# Altium project amoled-watch.PrjPcb
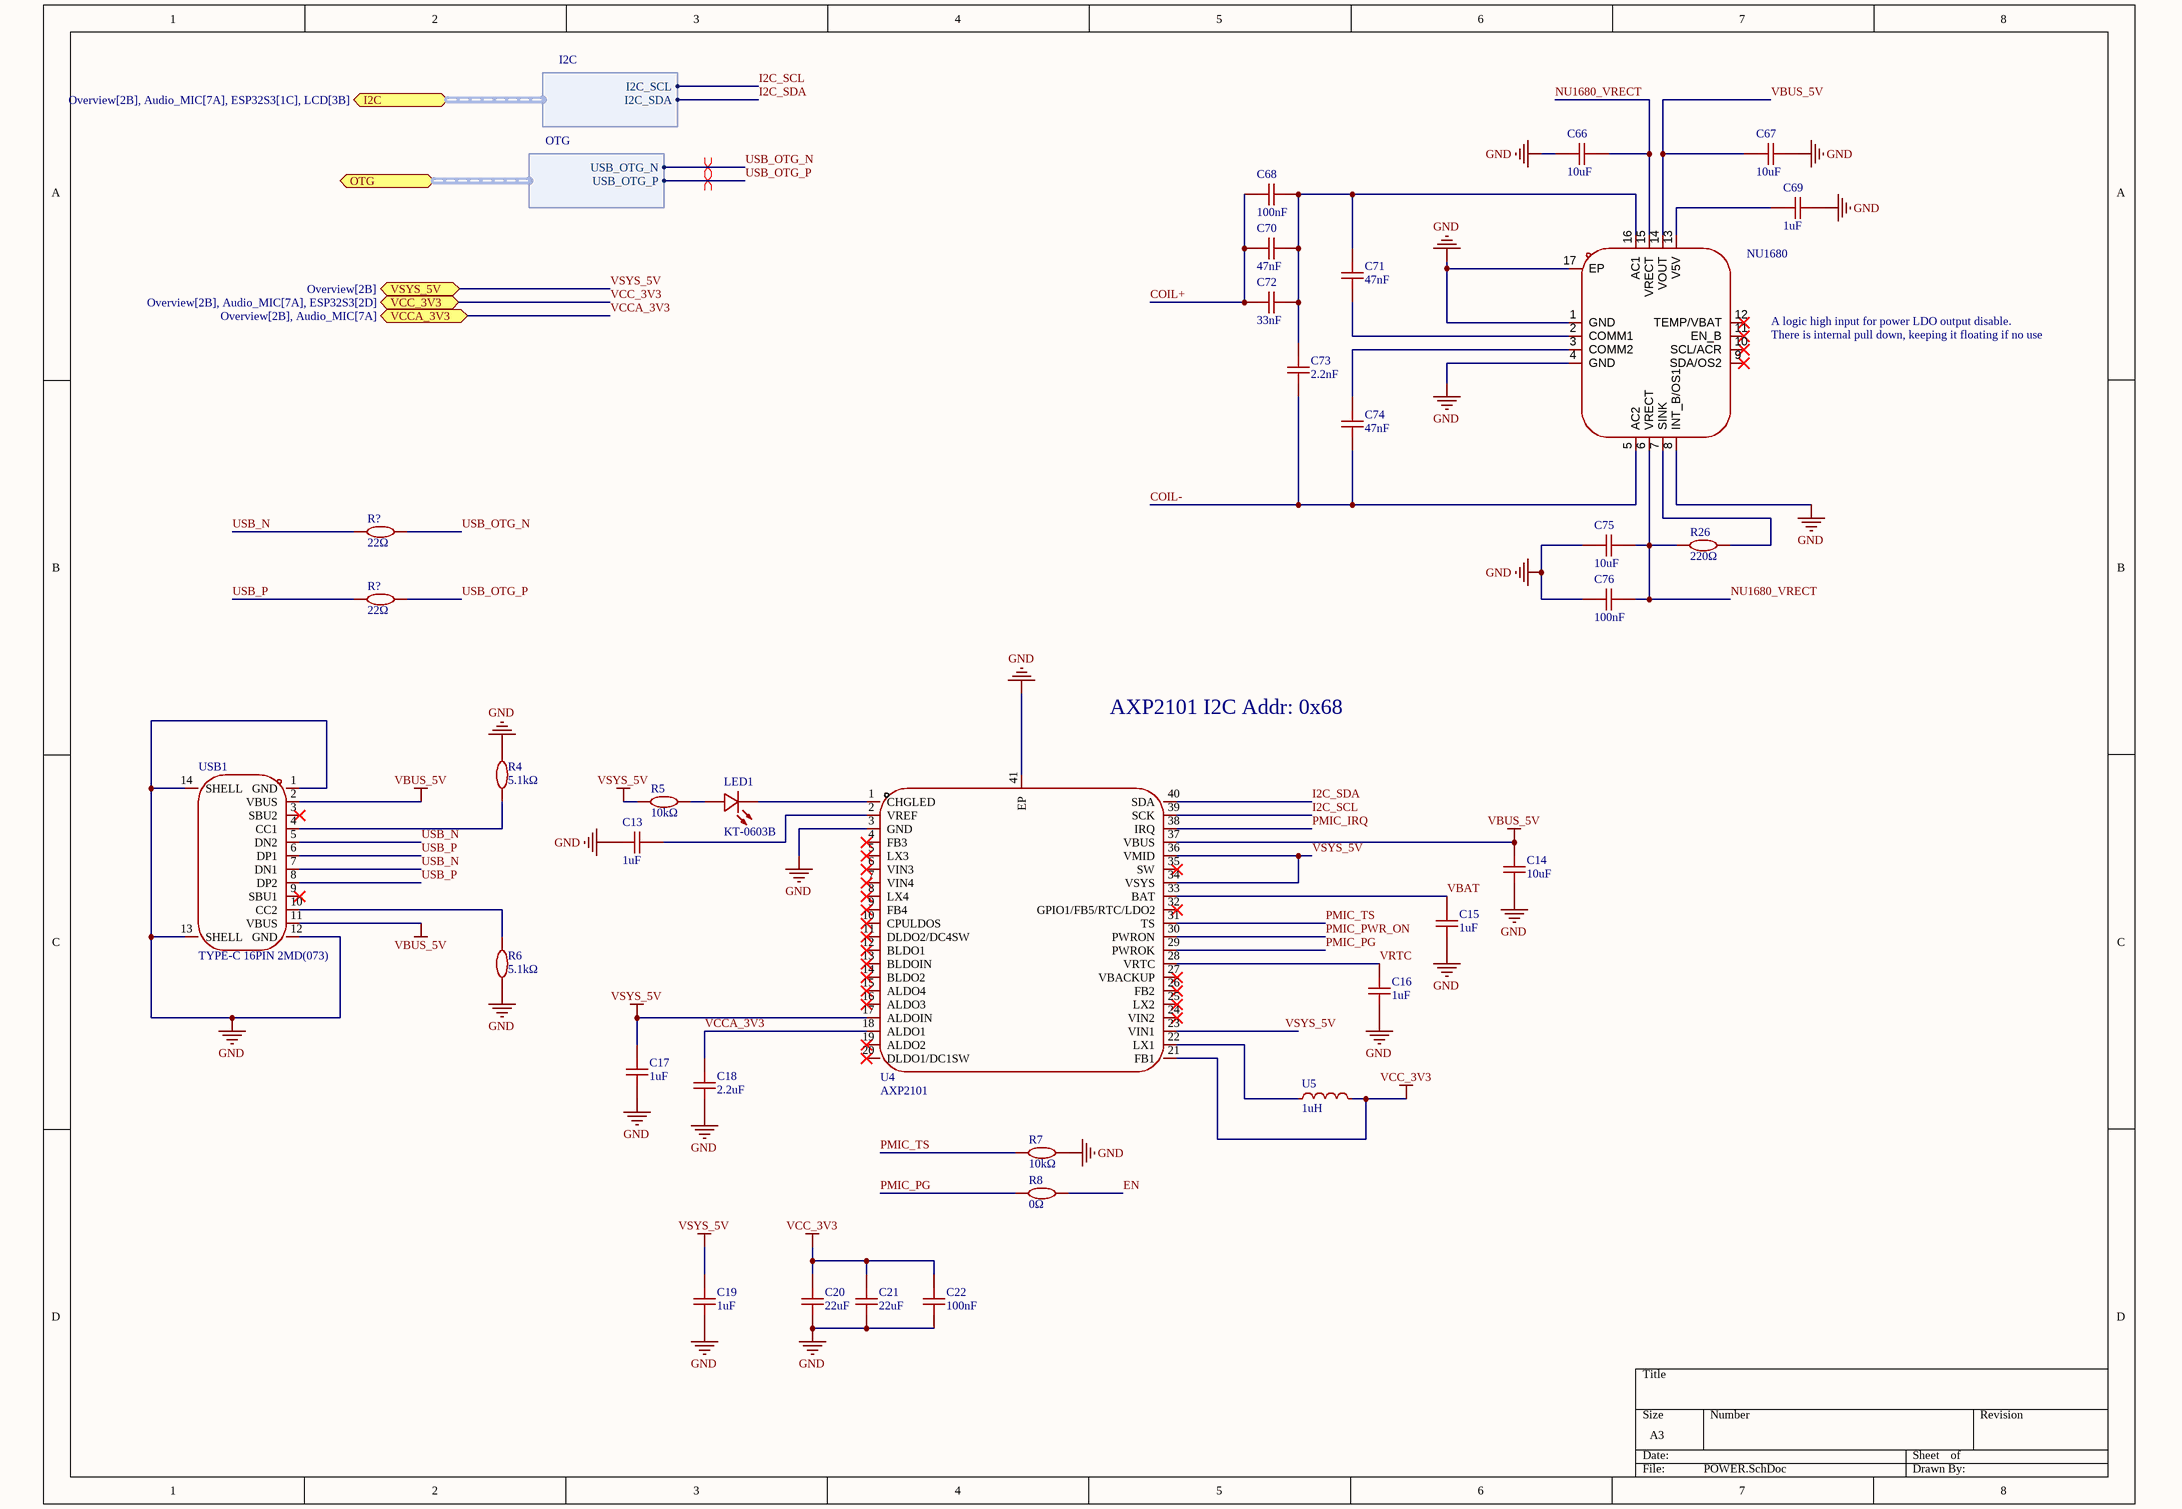
[diagram p0: POWER.SchDoc]
3 sheets, 77 parts. Net scope: flat (ports and power ports of the same name join across sheets).
Board file: PCB1.PcbDoc
Sheets:
  POWER.SchDoc
  ESP32S3.SchDoc
  Sensor.SchDoc

## Sheet POWER.SchDoc
size A3; SheetNumber: 2; SheetTotal: 7

### Parts
(Parts that share a designator on the sheet are numbered #1, #2 ... from top to bottom, then left to right.)
C13  1uF  [C0402]
C14  10uF  [C0603]
C15  1uF  [C0402]
C16  1uF  [C0402]
C17  1uF  [C0402]
C18  2.2uF  [C0402]
C19  1uF  [C0402]
C20  22uF  [C0603]
C21  22uF  [C0603]
C22  100nF  [C0402]
C66  10uF  [C0603]
C67  10uF  [C0603]
C68  100nF  [C0402]
C69  1uF  [C0402]
C70  47nF  [C0402]
C71  47nF  [C0402]
C72  33nF  [C0402]
C73  2.2nF  [C0402]
C74  47nF  [C0402]
C75  10uF  [C0603]
C76  100nF  [C0402]
LED1  KT-0603B  [LED0603-BL]
R4  5.1kΩ  [R0402]
R5  10kΩ  [R0402]
R6  5.1kΩ  [R0402]
R7  10kΩ  [R0402]
R8  0Ω  [R0402]
R26  220Ω  [R0402]
R?#1  22Ω  [R0402]
R?#2  22Ω  [R0402]
U4  AXP2101  [QFN-40_L5.0-W5.0-P0.40-TL-EP3.4]
U5  1uH  [IND-SMD_L2.5-W2.0_WPN252012H]
U12  NU1680  [QFN-16_L3.0-W3.0-P0.50-TL-EP1.9]
USB1  TYPE-C 16PIN 2MD(073)  [USB-C-SMD_TYPE-C-6PIN-2MD-073]

### Ports
I2C (bidir, harness I2C, see Overview[2B], Audio_MIC[7A], ESP32S3[1C], LCD[3B]), OTG (bidir, harness OTG), VCC_3V3 (bidir, see Overview[2B], Audio_MIC[7A], ESP32S3[2D]), VCCA_3V3 (bidir, see Overview[2B], Audio_MIC[7A]), VSYS_5V (bidir, see Overview[2B])

### Harnesses
OTG: USB_OTG_N, USB_OTG_P
I2C: I2C_SCL, I2C_SDA

### Nets
GND: C13.1 C14.1 C15.1 C16.1 C17.1 C18.1 C19.1 C20.1 C21.1 C22.1 C66.2 C67.1 C69.1 C75.2 C76.2 R4.2 R6.1 R7.2 U4.3(GND) U4.41(EP) U12.1(GND) U12.4(GND) U12.8(INT_B/OS1) U12.17(EP) USB1.1(GND) USB1.12(GND) USB1.13(SHELL) USB1.14(SHELL)
VBUS_5V: C14.2 C67.2 U4.37(VBUS) U12.14(VOUT) USB1.2(VBUS) USB1.11(VBUS)
VCC_3V3: C20.2 C21.2 C22.2 U4.21(FB1) U5.2 ; port VCC_3V3
VSYS_5V: C17.2 C19.2 R5.1 U4.17(ALDOIN) U4.23(VIN1) U4.34(VSYS) U4.36(VMID) ; port VSYS_5V
COIL+: C68.2 C70.2 C72.2
COIL-: C73.1 C74.1 U12.5(AC2)
EN: R8.2
I2C_SCL: U4.39(SCK) ; port I2C.I2C_SCL
I2C_SDA: U4.40(SDA) ; port I2C.I2C_SDA
NU1680_VRECT: C66.1 C75.1 C76.1 R26.1 U12.6(VRECT) U12.15(VRECT)
PMIC_IRQ: U4.38(IRQ)
PMIC_PG: R8.1 U4.29(PWROK)
PMIC_PWR_ON: U4.30(PWRON)
PMIC_TS: R7.1 U4.31(TS)
USB_N: R?#1.2 USB1.5(DN2) USB1.7(DN1)
USB_OTG_N: R?#1.1 ; port OTG.USB_OTG_N
USB_OTG_P: R?#2.1 ; port OTG.USB_OTG_P
USB_P: R?#2.2 USB1.6(DP1) USB1.8(DP2)
VBAT: C15.2 U4.33(BAT)
VCCA_3V3: C18.2 U4.18(ALDO1) ; port VCCA_3V3
VRTC: C16.2 U4.28(VRTC)
NetC13_2: C13.2 U4.2(VREF)
NetC68_1: C68.1 C70.1 C71.2 C72.1 C73.2 U12.16(AC1)
NetC69_2: C69.2 U12.13(V5V)
NetC71_1: C71.1 U12.2(COMM1)
NetC74_2: C74.2 U12.3(COMM2)
NetLED1_1: LED1.1(K) U4.1(CHGLED)
NetLED1_2: LED1.2(A) R5.2
NetR4_1: R4.1 USB1.4(CC1)
NetR6_2: R6.2 USB1.10(CC2)
NetR26_2: R26.2 U12.7(SINK)
NetU4_22: U4.22(LX1) U5.1

Not connected (* = marked no-connect by the designer): U4 4(FB3)* 5(LX3)* 6(VIN3)* 7(VIN4)* 8(LX4)* 9(FB4)* 10(CPULDOS)* 11(DLDO2/DC4SW)* 12(BLDO1)* 13(BLDOIN)* 14(BLDO2)* 15(ALDO4)* 16(ALDO3)* 19(ALDO2)* 20(DLDO1/DC1SW)* 24(VIN2)* 25(LX2)* 26(FB2)* 27(VBACKUP)* 32(GPIO1/FB5/RTC/LDO2)* 35(SW)*; U12 9(SDA/OS2)* 10(SCL/ACR)* 11(EN_B)* 12(TEMP/VBAT)*; USB1 3(SBU2)* 9(SBU1)*

### Layout directives
differential pair: USB_OTG_N, USB_OTG_P

### Notes on the sheet
- (near U12) A logic high input for power LDO output disable.
- (near U12) There is internal pull down, keeping it floating if no use
- AXP2101 I2C Addr: 0x68

### Library data of the parts
C13 C15-C17 C19 C69 = 1uF: 50V 1uF X5R ±10% 0402 Ceramic Capacitors ROHS
C14 C66 C67 C75 = 10uF: 10V 10uF X5R ±10% 0603 Ceramic Capacitors ROHS
C18 C73 = 2.2uF: 50V 2.2uF NP0 0402 Ceramic Capacitors ROHS
C20 C21 = 22uF: 16V 22uF X5R ±20% 0603 Ceramic Capacitors ROHS
C22 C68 C76 = 100nF: 50V 100nF X7R ±10% 0402 Ceramic Capacitors ROHS
C70-C72 C74 = 470nF: 25V 470nF X5R ±10% 0402 Ceramic Capacitors ROHS
LED1 = KT-0603B: 30mA 2.6V~3.2V Blue 0603 LED Indication - Discrete ROHS
R4 R6 R?#1 R?#2 = 5.1kΩ: 5.1kΩ 62.5mW 50V ±100ppm/℃ Thick Film Resistor ±1% 0402 Chip Resistor - Surface Mount ROHS
R5 R7 = 10kΩ: 62.5mW 10kΩ 50V ±100ppm/℃ Thick Film Resistor ±1% 0402 Chip Resistor - Surface Mount ROHS
R8 = 0Ω: 0Ω 62.5mW 50V Thick Film Resistor ±1% 0402 Chip Resistor - Surface Mount ROHS
R26 = 220Ω: 小尺寸、重量轻。降低组装成本,与贴片机匹配。适用于波峰焊和回流焊
U5 = WPN252012H1R0MT
U12 = NU1680: 无线充电; Symbol: NU1680
USB1 = TYPE-C 16PIN 2MD(073): 16pin type-c

## Sheet ESP32S3.SchDoc
size A3; SheetNumber: 2; SheetTotal: 7
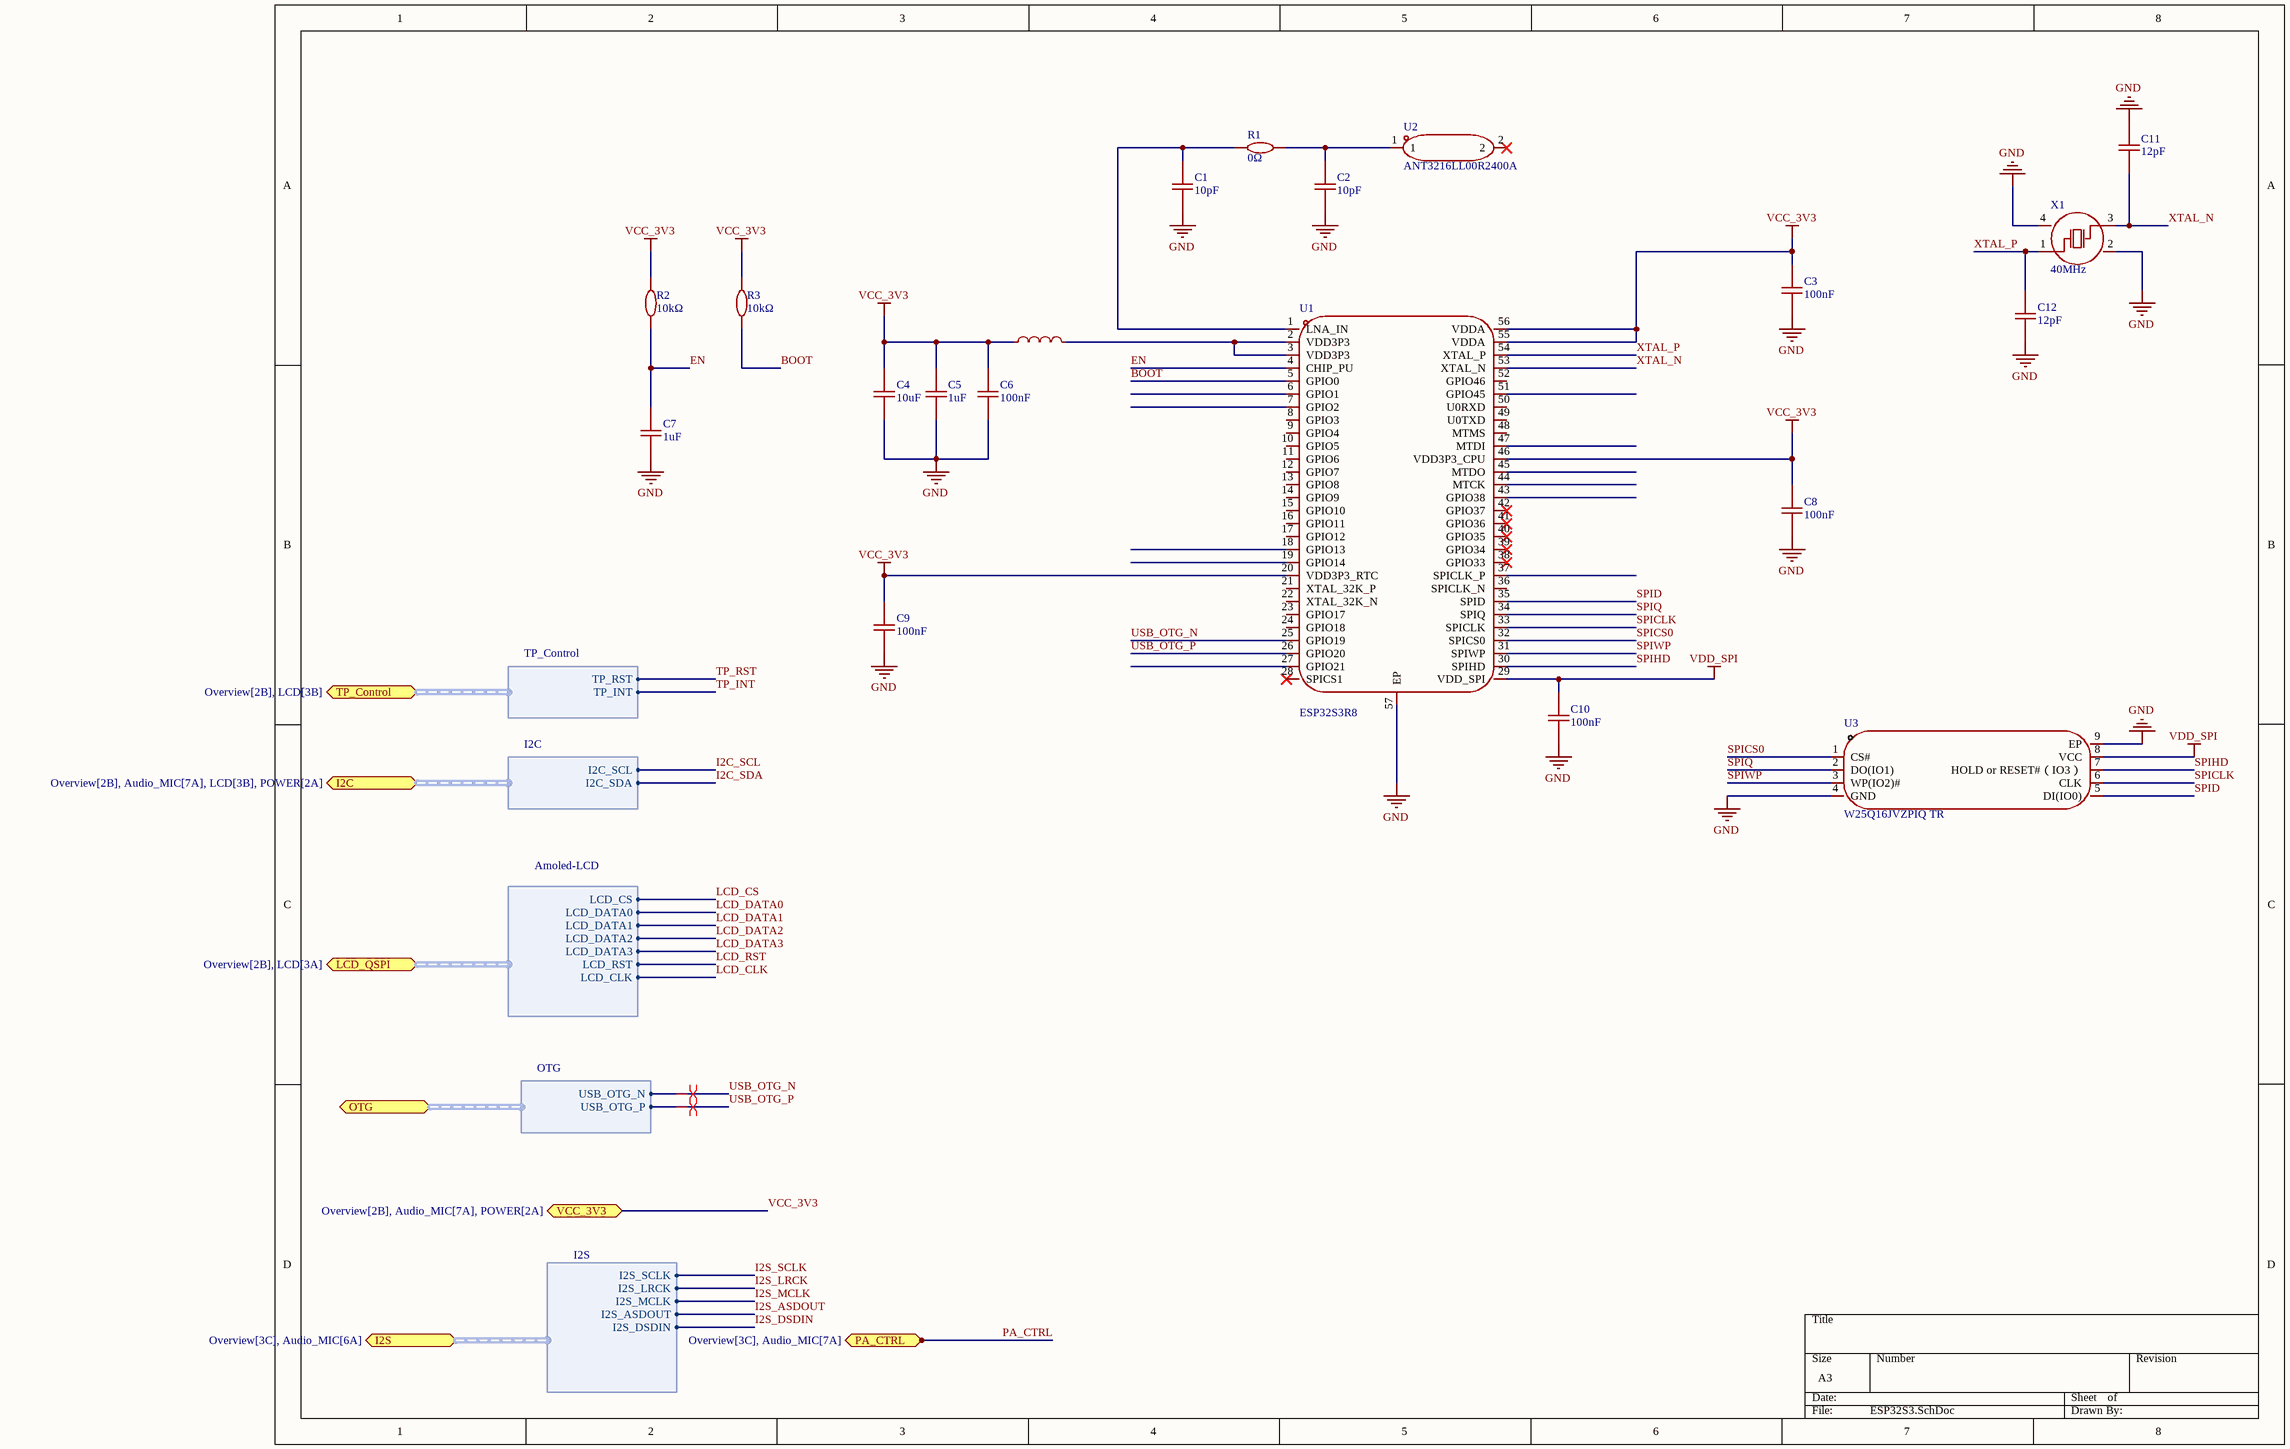
[diagram p1: ESP32S3.SchDoc]

### Parts
C1  10pF  [C0402]
C2  10pF  [C0402]
C3  100nF  [C0402]
C4  10uF  [C0603]
C5  1uF  [C0402]
C6  100nF  [C0402]
C7  1uF  [C0402]
C8  100nF  [C0402]
C9  100nF  [C0402]
C10  100nF  [C0402]
C11  12pF  [C0402]
C12  12pF  [C0402]
L1  2nH  [L0402]  (value not drawn)
R1  0Ω  [R0402]
R2  10kΩ  [R0402]
R3  10kΩ  [R0402]
U1  ESP32S3R8  [QFN-56_L7.0-W7.0-P0.40-TL-EP4.0]
U2  ANT3216LL00R2400A  [ANT-SMD_L3.2-W1.6]
U3  W25Q16JVZPIQ TR  [WSON-8_L6.0-W5.0-P1.27-BL-EP]
X1  40MHz  [OSC-SMD_4P-L3.2-W2.5-BL_SIT8008BI]

### Ports
I2C (bidir, harness I2C, see Overview[2B], Audio_MIC[7A], LCD[3B], POWER[2A]), I2S (bidir, harness I2S, see Overview[3C], Audio_MIC[6A]), LCD_QSPI (bidir, harness Amoled-LCD, see Overview[2B], LCD[3A]), OTG (bidir, harness OTG), PA_CTRL (bidir, see Overview[3C], Audio_MIC[7A]), TP_Control (bidir, harness TP_Control, see Overview[2B], LCD[3B]), VCC_3V3 (bidir, see Overview[2B], Audio_MIC[7A], POWER[2A])

### Harnesses
Amoled-LCD: LCD_CS, LCD_DATA0, LCD_DATA1, LCD_DATA2, LCD_DATA3, LCD_RST, LCD_CLK
I2C: I2C_SCL, I2C_SDA
TP_Control: TP_RST, TP_INT
OTG: USB_OTG_N, USB_OTG_P
I2S: I2S_SCLK, I2S_LRCK, I2S_MCLK, I2S_ASDOUT, I2S_DSDIN

### Nets
GND: C1.1 C2.1 C3.1 C4.1 C5.1 C6.1 C7.1 C8.1 C9.1 C10.1 C11.2 C12.1 U1.57(EP) U3.4(GND) U3.9(EP) X1.2(GND) X1.4(GND)
VCC_3V3: C3.2 C4.2 C5.2 C6.2 C8.2 C9.2 L1.1 R2.2 R3.2 U1.20(VDD3P3_RTC) U1.46(VDD3P3_CPU) U1.55(VDDA) U1.56(VDDA) ; port VCC_3V3
VDD_SPI: C10.2 U1.29(VDD_SPI) U3.8(VCC)
BOOT: R3.1 U1.5(GPIO0)
EN: C7.2 R2.1 U1.4(CHIP_PU)
I2S_ASDOUT: port I2S.I2S_ASDOUT
I2S_DSDIN: port I2S.I2S_DSDIN
I2S_LRCK: port I2S.I2S_LRCK
I2S_MCLK: port I2S.I2S_MCLK
I2S_SCLK: port I2S.I2S_SCLK
LCD_CLK: port LCD_QSPI.LCD_CLK
LCD_CS: port LCD_QSPI.LCD_CS
LCD_DATA0: port LCD_QSPI.LCD_DATA0
LCD_DATA1: port LCD_QSPI.LCD_DATA1
LCD_DATA2: port LCD_QSPI.LCD_DATA2
LCD_DATA3: port LCD_QSPI.LCD_DATA3
LCD_RST: port LCD_QSPI.LCD_RST
PA_CTRL: port PA_CTRL
SPICLK: U1.33(SPICLK) U3.6(CLK)
SPICS0: U1.32(SPICS0) U3.1(CS#)
SPID: U1.35(SPID) U3.5(DI(IO0))
SPIHD: U1.30(SPIHD) U3.7(HOLD_or_RESET#（IO3）)
SPIQ: U1.34(SPIQ) U3.2(DO(IO1))
SPIWP: U1.31(SPIWP) U3.3(WP(IO2)#)
TP_INT: port TP_Control.TP_INT
TP_RST: port TP_Control.TP_RST
USB_OTG_N: U1.25(GPIO19) ; port OTG.USB_OTG_N
USB_OTG_P: U1.26(GPIO20) ; port OTG.USB_OTG_P
XTAL_N: C11.1 U1.53(XTAL_N) X1.3(OSC2)
XTAL_P: C12.2 U1.54(XTAL_P) X1.1(OSC1)
NetC1_2: C1.2 R1.1 U1.1(LNA_IN)
NetC2_2: C2.2 R1.2 U2.1
NetL1_2: L1.2 U1.2(VDD3P3) U1.3(VDD3P3)

Not connected (* = marked no-connect by the designer): U1 6(GPIO1) 7(GPIO2) 8(GPIO3) 9(GPIO4) 10(GPIO5) 11(GPIO6) 12(GPIO7) 13(GPIO8) 14(GPIO9) 15(GPIO10) 16(GPIO11) 17(GPIO12) 18(GPIO13) 19(GPIO14) 21(XTAL_32K_P) 22(XTAL_32K_N) 23(GPIO17) 24(GPIO18) 27(GPIO21) 28(SPICS1)* 36(SPICLK_N) 37(SPICLK_P) 38(GPIO33)* 39(GPIO34)* 40(GPIO35)* 41(GPIO36)* 42(GPIO37)* 43(GPIO38) 44(MTCK) 45(MTDO) 47(MTDI) 48(MTMS) 49(U0TXD) 50(U0RXD) 51(GPIO45) 52(GPIO46); U2 2*

### Layout directives
differential pair: USB_OTG_N, USB_OTG_P

### Library data of the parts
C1 C2 = 10pF: 50V 10pF C0G ±5% 0402 Ceramic Capacitors ROHS
C3 C6 C8-C10 = 100nF: as C22 on sheet POWER
C4 = 10uF: as C14 on sheet POWER
C5 C7 = 1uF: as C13 on sheet POWER
C11 C12 = 12pF: 50V 12pF C0G ±5% 0402 Ceramic Capacitors ROHS
L1 = MLG1005S2N0BT000: L0402 2nH ±0.1nH; Manufacturer: Sunltech(顺磁); Symbol: SLW4030S1R0NST; Add into BOM: yes; Value: 1uH; Tolerance: ±30%; Current Rating: 4.15A; DC Resistance(DCR): 18mΩ; Device: SLW4030S1R0NST; LCSC Part Name: 1uH ±30%; Supplier Part: C206354; Manufacturer Part: SLW4030S1R0NST; Supplier Footprint: SMD,4x4mm; JLCPCB Part Class: Extended Part; Datasheet: https://item.szlcsc.com/datasheet/SLW4030S1R0NST/207399.html; Supplier: LCSC; Convert to PCB: yes
R1 = 0Ω: as R8 on sheet POWER
R2 R3 = 10kΩ: as R5 on sheet POWER
U1 = ESP32S3R8: 2.4GHz Wi-Fi + 低功耗蓝牙系统级芯片（SoC）
U3 = W25Q16JVZPIQ TR: WSON-8-EP(5x6) W25Q128JV（128M位）串行闪存为空间、引脚和电源受限的系统提供了存储解决方案。25Q系列具备灵活性和高性能。
X1 = X322540MPB4SI: Crystal Oscillator 15pF SMD3225-4P Crystals ROHS

## Sheet Sensor.SchDoc
size A3; SheetNumber: 7; SheetTotal: 7
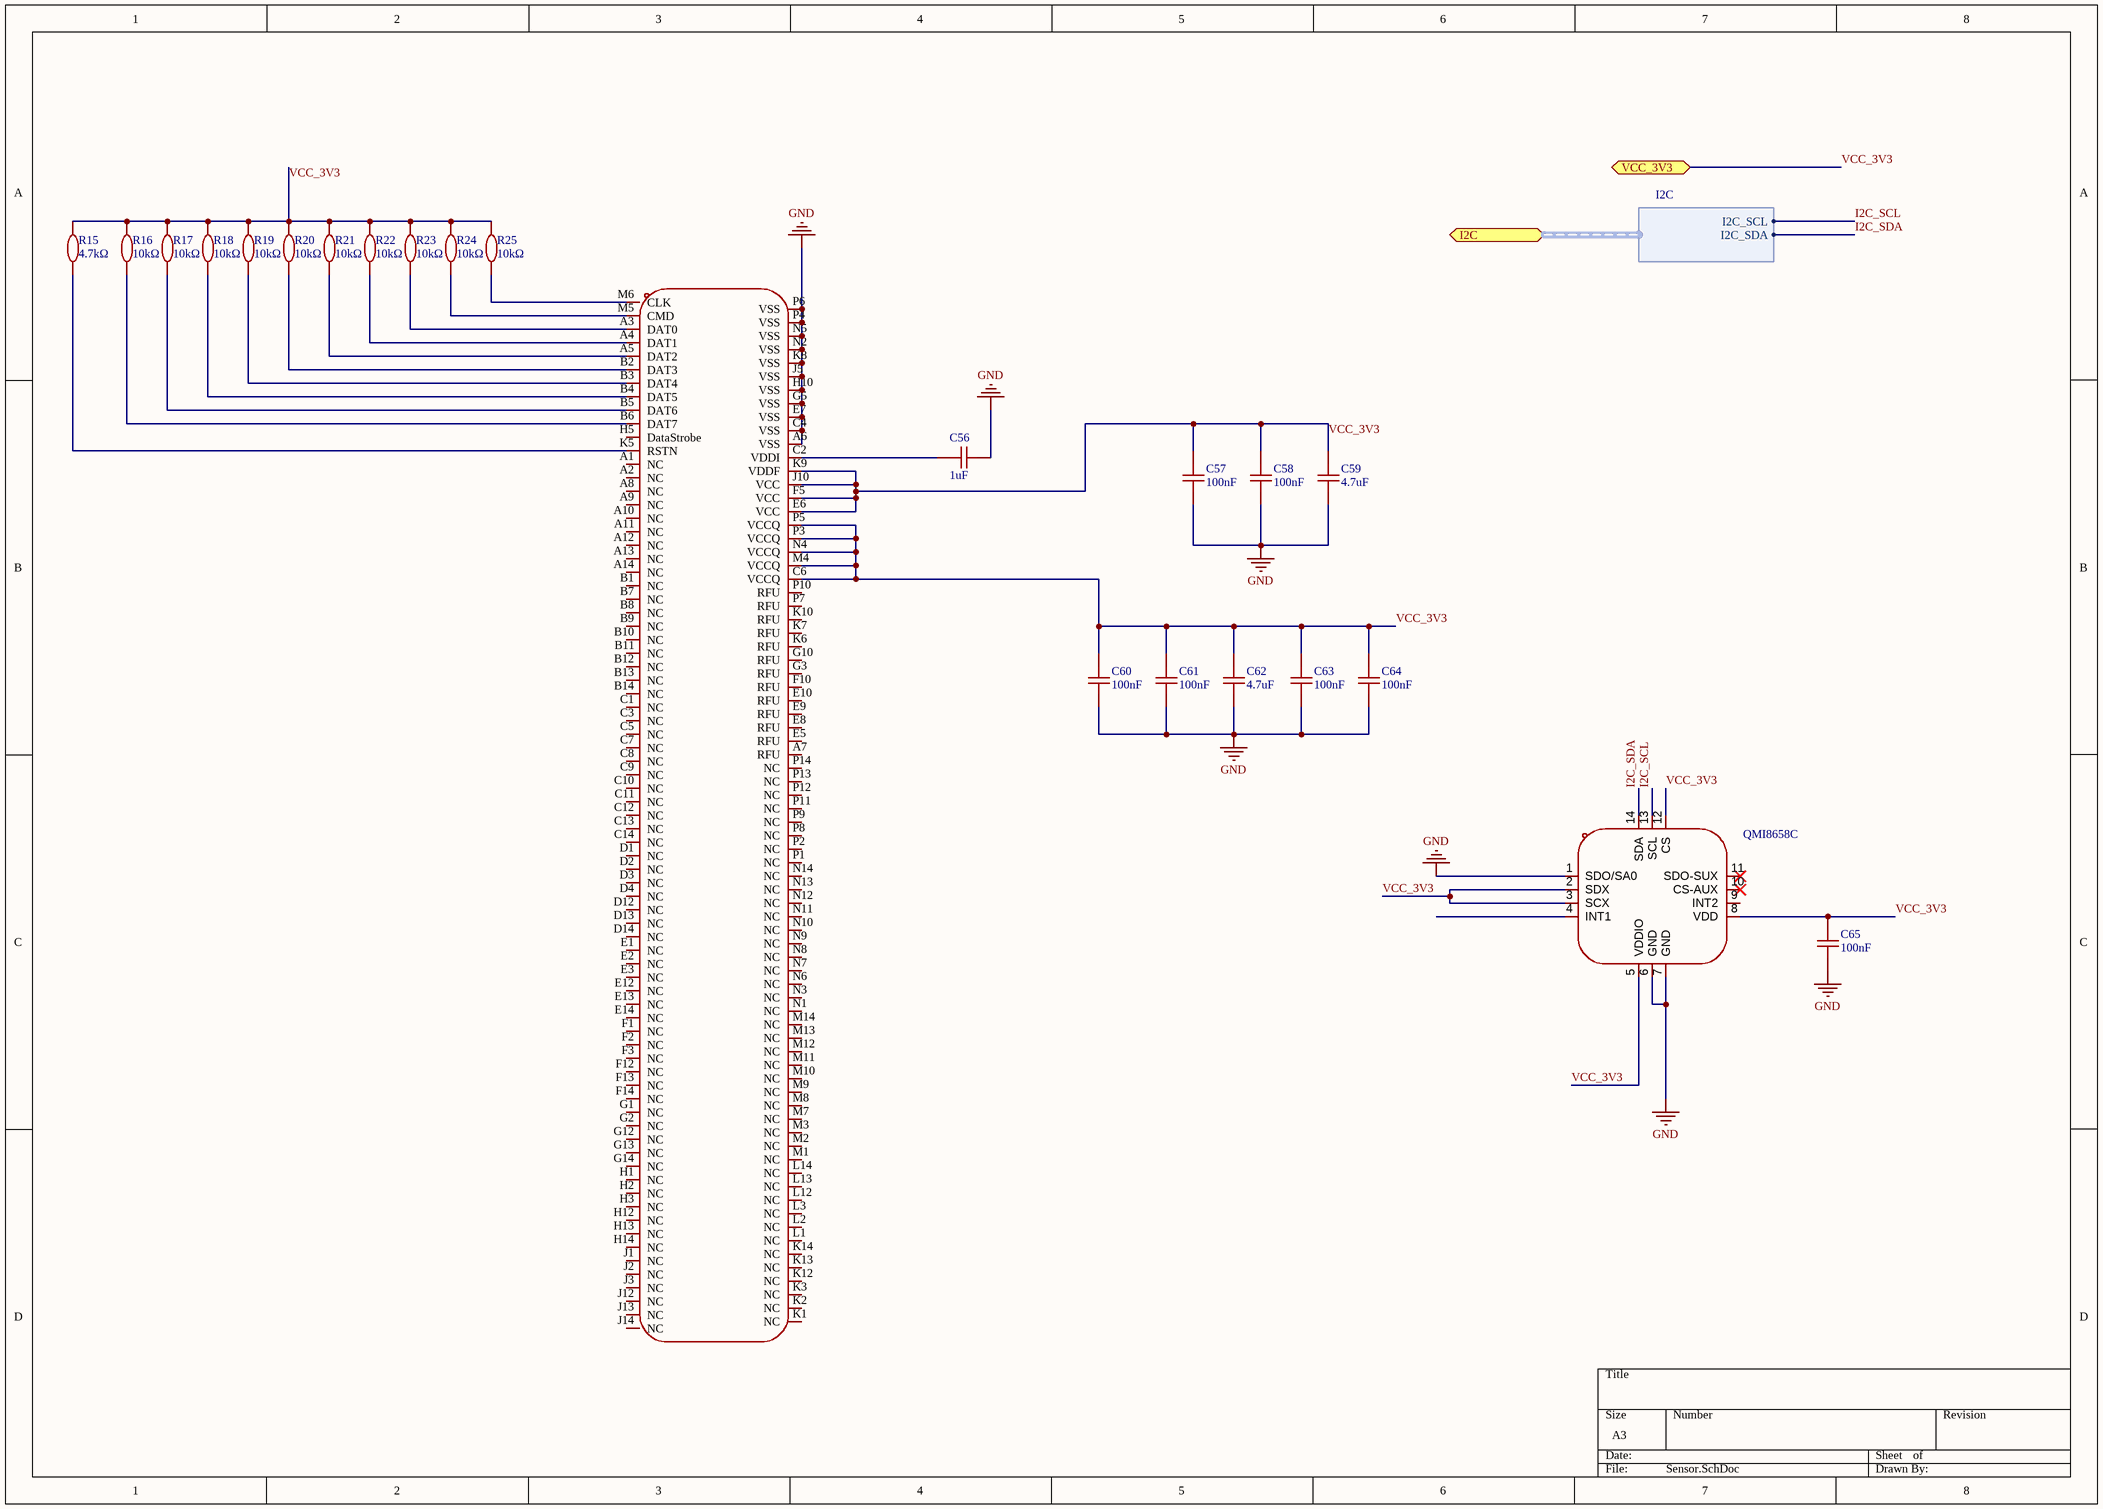
[diagram p2: Sensor.SchDoc]

### Parts
C56  1uF  [C0402]
C57  100nF  [C0402]
C58  100nF  [C0402]
C59  4.7uF  [C0402]
C60  100nF  [C0402]
C61  100nF  [C0402]
C62  4.7uF  [C0402]
C63  100nF  [C0402]
C64  100nF  [C0402]
C65  100nF  [C0402]
R15  4.7kΩ  [R0402]
R16  10kΩ  [R0402]
R17  10kΩ  [R0402]
R18  10kΩ  [R0402]
R19  10kΩ  [R0402]
R20  10kΩ  [R0402]
R21  10kΩ  [R0402]
R22  10kΩ  [R0402]
R23  10kΩ  [R0402]
R24  10kΩ  [R0402]
R25  10kΩ  [R0402]
U10  QMI8658C  [LGA-14_L3.0-W2.5-P0.50-BR]
U11  KLM8G1GETF-B041  [FBGA-153_L13.0-W11.5-P0.50_KLMAG1JETD-B041]  (value not drawn)

### Ports
I2C (bidir, harness I2C), VCC_3V3 (bidir)

### Harnesses
I2C: I2C_SCL, I2C_SDA

### Nets
GND: C56.2 C57.1 C58.1 C59.1 C60.1 C61.1 C62.1 C63.1 C64.1 C65.1 U10.1(SDO/SA0) U10.6(GND) U10.7(GND) U11.A6(VSS) U11.C4(VSS) U11.E7(VSS) U11.G5(VSS) U11.H10(VSS) U11.J5(VSS) U11.K8(VSS) U11.N2(VSS) U11.N5(VSS) U11.P4(VSS) U11.P6(VSS)
VCC_3V3: C57.2 C58.2 C59.2 C60.2 C61.2 C62.2 C63.2 C64.2 C65.2 R15.2 R16.2 R17.2 R18.2 R19.2 R20.2 R21.2 R22.2 R23.2 R24.2 R25.2 U10.2(SDX) U10.3(SCX) U10.5(VDDIO) U10.8(VDD) U10.12(CS) U11.C6(VCCQ) U11.E6(VCC) U11.F5(VCC) U11.J10(VCC) U11.K9(VDDF) U11.M4(VCCQ) U11.N4(VCCQ) U11.P3(VCCQ) U11.P5(VCCQ) ; port VCC_3V3
I2C_SCL: U10.13(SCL) ; port I2C.I2C_SCL
I2C_SDA: U10.14(SDA) ; port I2C.I2C_SDA
NetC56_1: C56.1 U11.C2(VDDI)
NetR15_1: R15.1 U11.K5(RSTN)
NetR16_1: R16.1 U11.B6(DAT7)
NetR17_1: R17.1 U11.B5(DAT6)
NetR18_1: R18.1 U11.B4(DAT5)
NetR19_1: R19.1 U11.B3(DAT4)
NetR20_1: R20.1 U11.B2(DAT3)
NetR21_1: R21.1 U11.A5(DAT2)
NetR22_1: R22.1 U11.A4(DAT1)
NetR23_1: R23.1 U11.A3(DAT0)
NetR24_1: R24.1 U11.M5(CMD)
NetR25_1: R25.1 U11.M6(CLK)

Not connected (* = marked no-connect by the designer): U10 4(INT1) 9(INT2) 10(CS-AUX)* 11(SDO-SUX)*; U11 A1(NC) A2(NC) A7(RFU) A8(NC) A9(NC) A10(NC) A11(NC) A12(NC) A13(NC) A14(NC) B1(NC) B7(NC) B8(NC) B9(NC) B10(NC) B11(NC) B12(NC) B13(NC) B14(NC) C1(NC) C3(NC) C5(NC) C7(NC) C8(NC) C9(NC) C10(NC) C11(NC) C12(NC) C13(NC) C14(NC) D1(NC) D2(NC) D3(NC) D4(NC) D12(NC) D13(NC) D14(NC) E1(NC) E2(NC) E3(NC) E5(RFU) E8(RFU) E9(RFU) E10(RFU) E12(NC) E13(NC) E14(NC) F1(NC) F2(NC) F3(NC) F10(RFU) F12(NC) F13(NC) F14(NC) G1(NC) G2(NC) G3(RFU) G10(RFU) G12(NC) G13(NC) G14(NC) H1(NC) H2(NC) H3(NC) H5(DataStrobe) H12(NC) H13(NC) H14(NC) J1(NC) J2(NC) J3(NC) J12(NC) J13(NC) J14(NC) K1(NC) K2(NC) K3(NC) K6(RFU) K7(RFU) K10(RFU) K12(NC) K13(NC) K14(NC) L1(NC) L2(NC) L3(NC) L12(NC) L13(NC) L14(NC) M1(NC) M2(NC) M3(NC) M7(NC) M8(NC) M9(NC) M10(NC) M11(NC) M12(NC) M13(NC) M14(NC) N1(NC) N3(NC) N6(NC) N7(NC) N8(NC) N9(NC) N10(NC) N11(NC) N12(NC) N13(NC) N14(NC) P1(NC) P2(NC) P7(RFU) P8(NC) P9(NC) P10(RFU) P11(NC) P12(NC) P13(NC) P14(NC)

### Library data of the parts
C56 = 1uF: as C13 on sheet POWER
C57 C58 C60 C61 C63-C65 = 100nF: as C22 on sheet POWER
C59 C62 = 4.7uF: 10V 4.7uF X5R ±20% 0402 Ceramic Capacitors ROHS
R15-R25 = 10kΩ: as R5 on sheet POWER
U10 = QMI8658C: 低噪声、宽带宽6D惯性测量单元，带运动协处理器和传感器融合功能; Symbol: QMI8658C
U11 = KLM8G1GETF-B041_1: 8GB 2.7V~3.6V eMMC 5.1 330/50 MB/s FBGA-153(11.5x13) Memory (ICs) ROHS; Manufacturer: SAMSUNG(三星半导体); Add into BOM: yes; Reading Speed in Sequence: 330MB/S; Writing Speed in Sequence: 50MB/S; Controller Operating Voltage (VCCQ): 2.7V~3.6V；1.7V~1.95V; Symbol: KLM8G1GETF-B041; Device: KLM8G1GETF-B041; LCSC Part Name: KLM8G1GETF-B041; Supplier Part: C499918; Manufacturer Part: KLM8G1GETF-B041; Supplier Footprint: FBGA-153(11.5x13); JLCPCB Part Class: Extended Part; Datasheet: https://item.szlcsc.com/datasheet/KLM8G1GETF-B041/512098.html; Supplier: LCSC; Convert to PCB: yes; configuration: -; Interface: eMMC 5.1; Voltage - Supply: 2.7V~3.6V; Operating Temperature: -25℃~+85℃; Sequential Read/Write (MB/s): 330/50 MB/s; Random Read/Write (IOPS): -; Memory Size: 8GB; NAND Operating Voltage (VCCF): 2.7V~3.6V

## Nets that join several sheets
GND: POWER (28 pins), ESP32S3 (17 pins), Sensor (24 pins)
VCC_3V3: POWER (5 pins), ESP32S3 (13 pins), Sensor (34 pins)
I2C_SCL: POWER (U4.39), Sensor (U10.13)
I2C_SDA: POWER (U4.40), Sensor (U10.14)
USB_OTG_N: POWER (R?#1.1), ESP32S3 (U1.25)
USB_OTG_P: POWER (R?#2.1), ESP32S3 (U1.26)